# EAGLE design js-wl-msp430 (EAGLE 6.1)
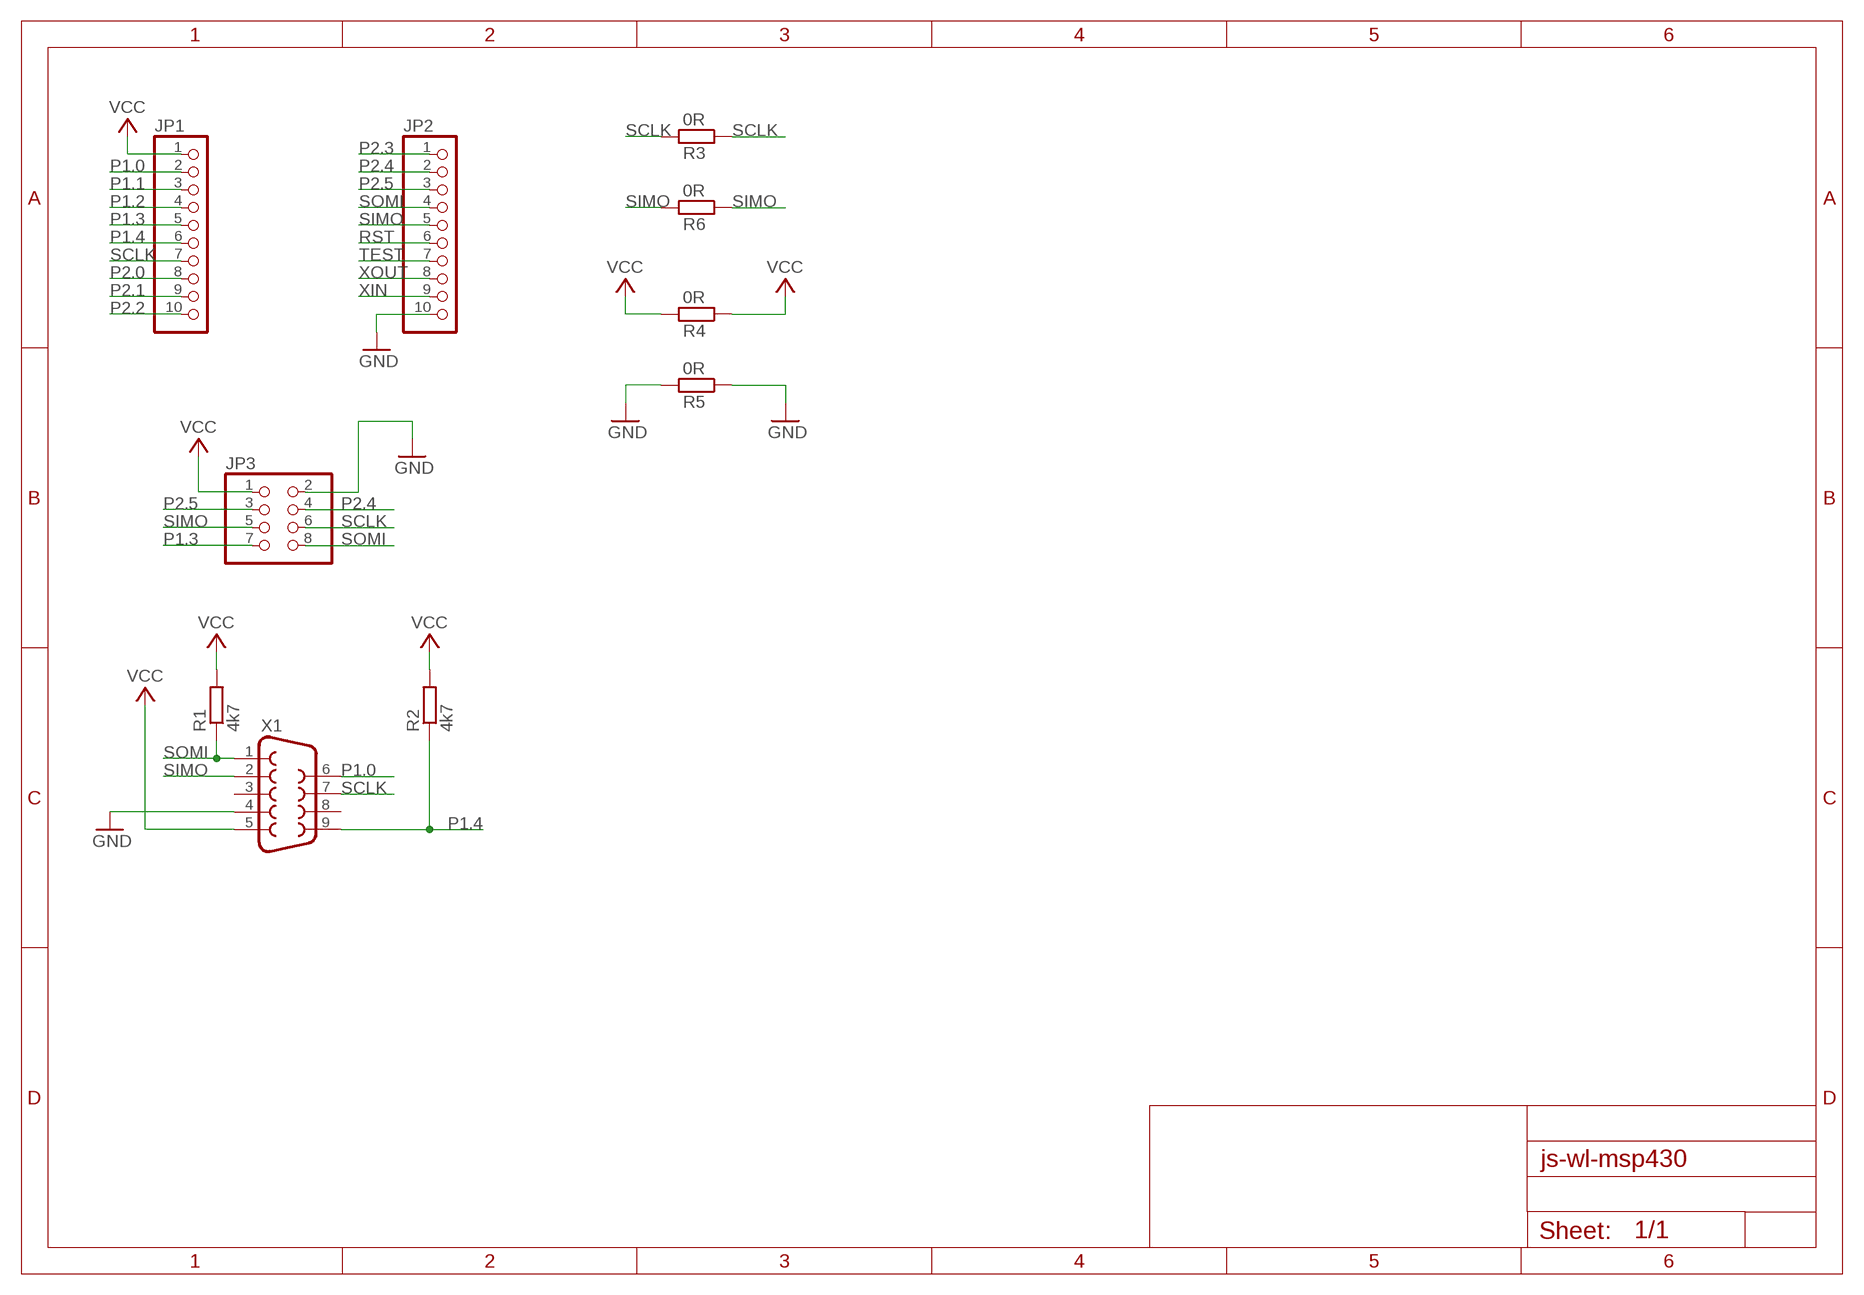
[diagram p0: schematic, sheet 1]

## Parts
JP1  PINHD-1X10  [1X10]
JP2  PINHD-1X10  [1X10]
JP3  PINHD-2X4  [2X04]
R1  4k7  R-EU_R1206  [R1206]
R2  4k7  R-EU_R1206  [R1206]
R3  0R  R-EU_R1206  [R1206]
R4  0R  R-EU_0207/12  [0207/12]
R5  0R  R-EU_0207/12  [0207/12]
R6  0R  R-EU_0207/12  [0207/12]
X1  DB9MALE  [DB9_MALE]

## Nets
GND: JP2.10 JP3.2 R5.1 R5.2 X1.4
P1.0: JP1.2 X1.6
P1.1: JP1.3
P1.2: JP1.4
P1.3: JP1.5 JP3.7
P1.4: JP1.6 R2.1 X1.9
P2.0: JP1.8
P2.1: JP1.9
P2.2: JP1.10
P2.3: JP2.1
P2.4: JP2.2 JP3.4
P2.5: JP2.3 JP3.3
RST: JP2.6
SCLK: JP1.7 JP3.6 R3.1 R3.2 X1.7
SIMO: JP2.5 JP3.5 R6.1 R6.2 X1.2
SOMI: JP2.4 JP3.8 R1.1 X1.1
TEST: JP2.7
VCC: JP1.1 JP3.1 R1.2 R2.2 R4.1 R4.2 X1.5
XIN: JP2.9
XOUT: JP2.8
Unconnected: X1.3 X1.8

## Library data of the parts
JP1 JP2 = pinhead:PINHD-1X10: PIN HEADER
JP3 = pinhead:PINHD-2X4: PIN HEADER
R1-R6 = rcl:R-EU_: RESISTOR, European symbol
X1 = SparkFun:DB9: DB9 Connector Standard DB9 (D-Sub 9) serial connector. Can be used for CAN bus as well as RS485 and RS232. Footprint production proven. Spark Fun Electronics SKU : PRT-00429

## Board
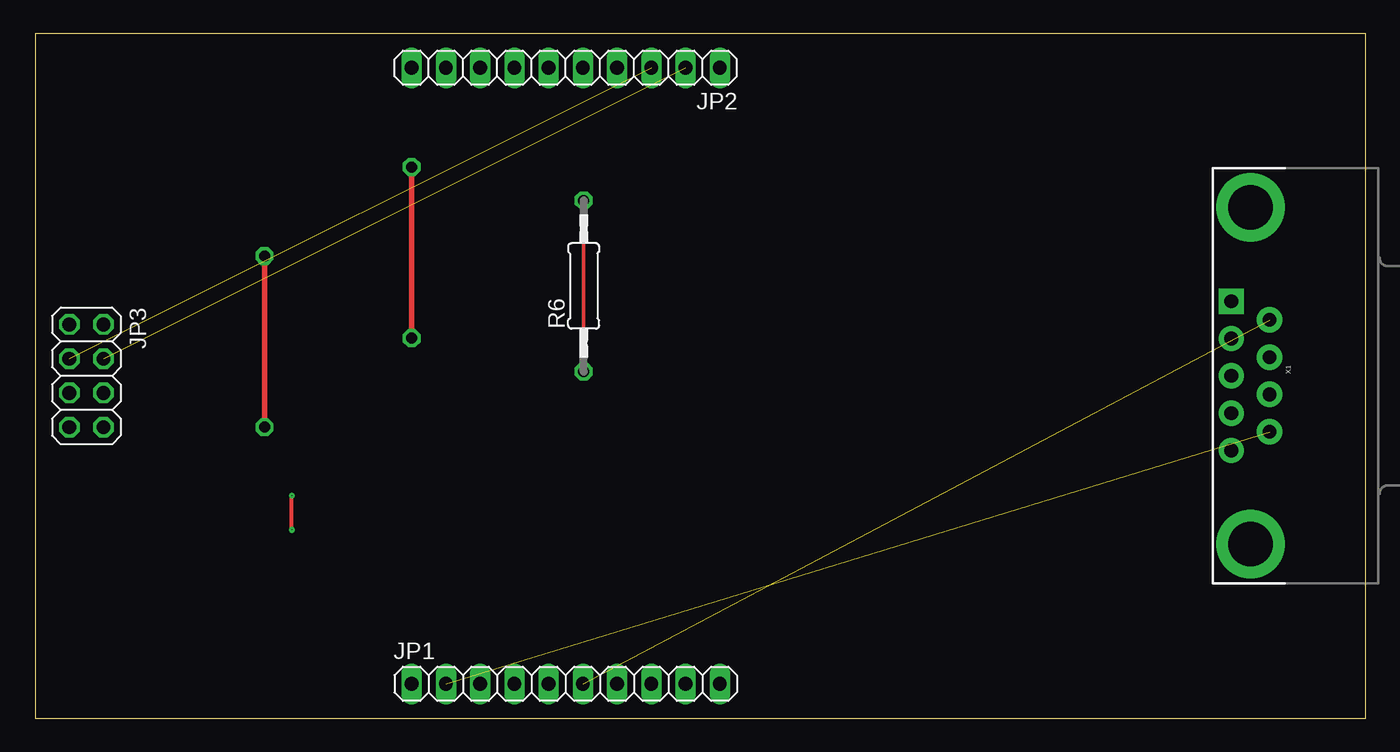
[diagram p1: board, top side]
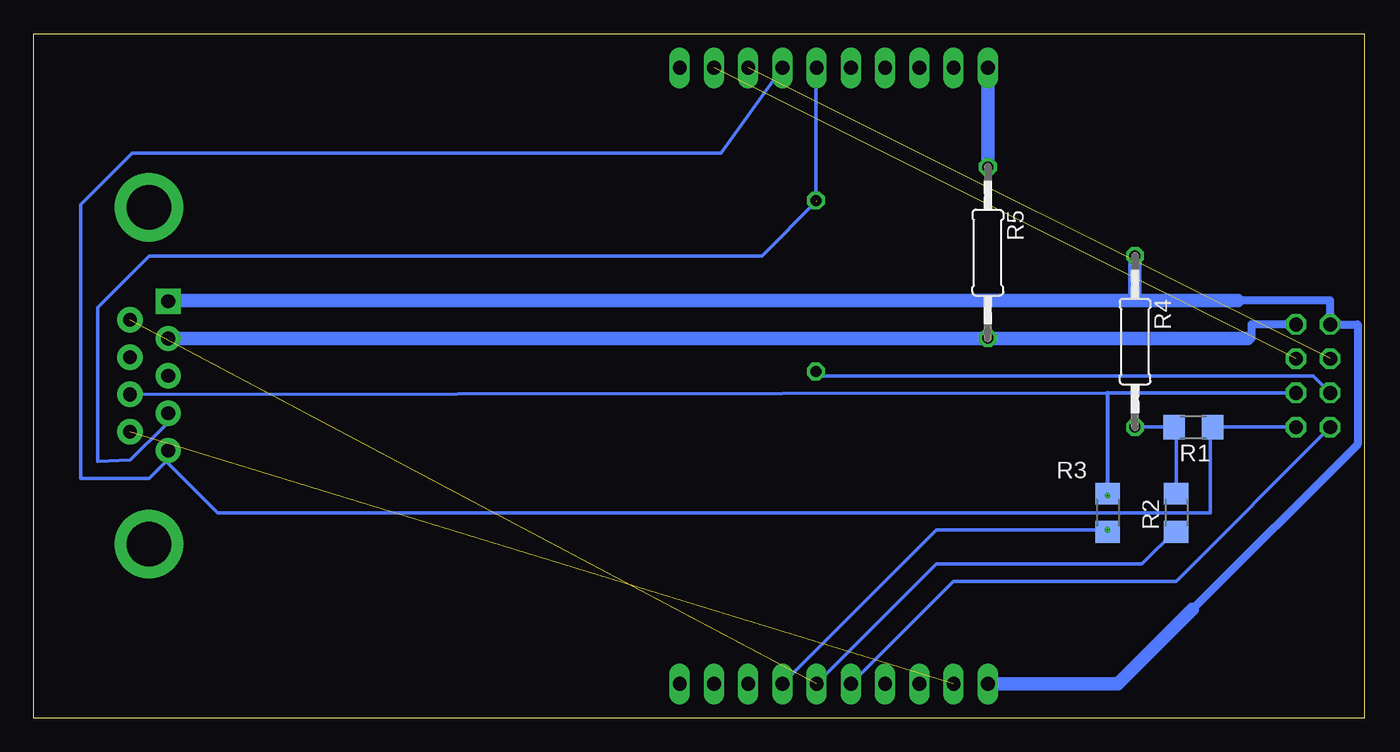
[diagram p2: board, bottom side, seen from below]

Size 98.73 x 50.79 mm. Coordinates in mm from the lower left corner, seen from the top.
Outline: 0,0 98.73,0 98.73,50.79 0,50.79 0,0
Copper layers (1*16): Top 0.035mm / dielectric 1.5mm / Bottom 0.035mm
Design rules: minimum track width 10mil, minimum drill 24mil, track to track 8mil, track to pad 8mil, pad to pad 8mil, via to via 8mil, smd to smd 8mil, copper to edge 40mil, drill to drill 8mil, minimum pad ring 10mil, minimum via ring 8mil, stop-mask expansion 4mil, vias tented up to drill 0mil, thermal gap 10mil

### Footprints (pad centres in the part's own frame; a part is rotated, then mirrored left to right if it is on the bottom)
1X10 = drill 1.016 long: 1 -11.43,0; 2 -8.89,0; 3 -6.35,0; 4 -3.81,0; 5 -1.27,0; 6 1.27,0; 7 3.81,0; 8 6.35,0; 9 8.89,0; 10 11.43,0
2X04 = drill 1.016 octagon: 1 -3.81,-1.27; 2 -3.81,1.27; 3 -1.27,-1.27; 4 -1.27,1.27; 5 1.27,-1.27; 6 1.27,1.27; 7 3.81,-1.27; 8 3.81,1.27
R1206 = smd 1.6 x 1.803: 1 -1.422,0; 2 1.422,0
0207/12 = drill 0.813 octagon: 1 -6.35,0; 2 6.35,0
DB9_MALE = drill 1.016 pad 1.88: 1 5.54,-1.42; 2 2.77,-1.42; 3 0,-1.42; 4 -2.77,-1.42; 6 4.15,1.42; 7 1.38,1.42; 8 -1.38,1.42; 9 -4.15,1.42 | drill 1.016 pad 1.88 square: 5 -5.54,-1.42 | drill 3.302 pad 5.08: G1 -12.5,0; G2 12.5,0

### Placement (x,y rotation side)
JP1  39.37,2.54 0 top
JP2  39.37,48.26 180 top
JP3  3.81,25.4 270 top
R1  12.7,21.59 180 bottom
R2  13.97,15.24 90 bottom
R3  19.05,15.24 90 bottom
R4  17.02,27.94 270 bottom
R5  27.94,34.54 270 bottom
R6  40.7,32.07 90 top
X1  90.17,25.4 270 top

### Tracks (layer width: path | path; a pad name or v marks a point on that pad's centre or on a via)
GND  (via drill 0.03 pad 0.03)
  Top 0.406: R5.2 R5.1
  Bottom 0.406: 8.38,28.17 8.64,28.17 8.64,28.19 R5.2
  Bottom 0.61: JP3.2 8.38,29.21 8.38,28.17
  Bottom 1.016: R5.1 JP2.10 | X1.4 8.64,28.17
  other vias: 27.94,28.19 27.94,40.89
N$1
  Bottom 1.016: 9.4,30.99 17.02,30.99
P1.0  (1 unrouted)
P1.3
  Bottom 0.254: JP3.7 13.97,10.16 30.48,10.16 JP1.5
P1.4  (1 unrouted)
  Bottom 0.254: JP1.6 31.75,11.43 16.51,11.43 13.97,13.97 R2.1
P2.4  (1 unrouted)
P2.5  (1 unrouted)
SCLK  (via drill 0.03 pad 0.03)
  Top 0.305: v19.05,13.97 v19.05,16.51
  Bottom 0.254: 91.44,24.03 19.05,24.13 JP3.6 | R3.1 v19.05,13.97 31.75,13.97 JP1.7
  Bottom 0.305: R3.2 19.05,24.13
  Bottom 0.406: R3.2 v19.05,16.51 | 91.44,24.03 91.59,24.13 X1.7
SIMO  (1 unrouted)
  Top 0.254: R6.1 R6.2
  Bottom 0.254: JP3.5 3.81,25.4 40.39,25.4 R6.1 | X1.2 88.9,22.86 89.03,21.69 91.57,19.15 93.98,19.05 93.98,30.48 90.17,34.29 44.7,34.29 40.64,38.35 | R6.2 40.7,48.2 JP2.5
SOMI
  Bottom 0.254: JP3.8 R1.1 11.43,21.59 11.43,15.24 85.09,15.24 88.9,19.05 | JP2.4 47.75,41.91 91.44,41.91 95.25,38.1 95.25,17.78 90.17,17.78 88.9,19.05 | 88.9,19.05 X1.1
VCC  (via drill 0.03 pad 0.03)
  Top 0.406: R4.1 R4.2
  Bottom 0.254: 13.97,16.51 R2.2 13.97,21.59 R1.2 R4.2 | 88.9,30.99 X1.5
  Bottom 0.61: 12.76,8.06 0.51,20.32 0.51,29.21 JP3.1 2.54,30.99 17.02,30.99
  Bottom 1.016: JP1.1 18.29,2.54 12.76,8.06 | 88.9,30.99 17.02,30.99 R4.1
  other vias: 17.02,34.29 17.02,21.59